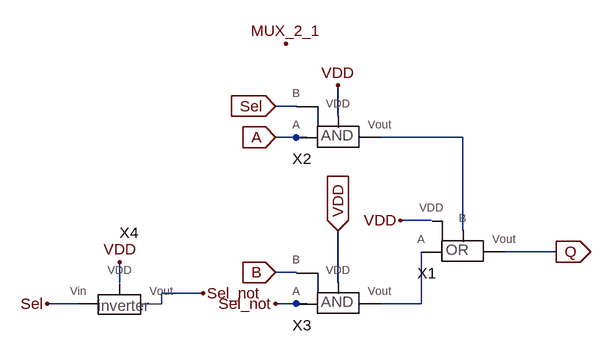
[diagram p0: schematic MUX_2_1.asc]
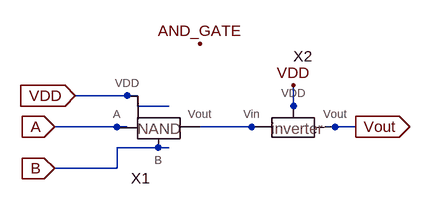
[diagram p1: sub-circuit and_gate.asc]
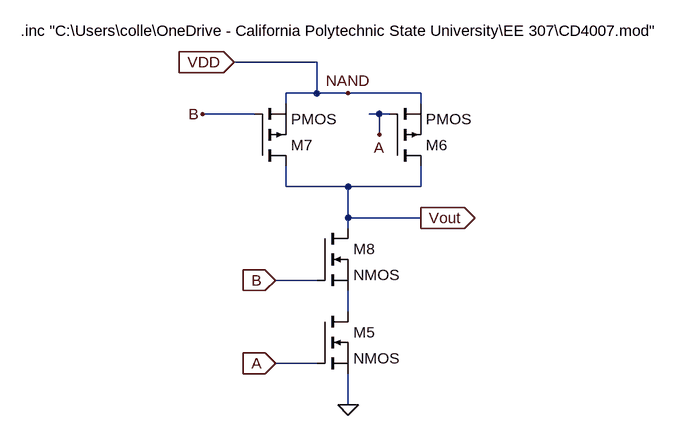
[diagram p2: sub-circuit nand_gate.asc]
MUX_2_1.asc, the LTspice schematic file:
Version 4
SHEET 1 880 680
WIRE -48 -80 -80 -80
WIRE 16 -64 16 -112
WIRE -48 -32 -80 -32
WIRE -32 -32 -48 -32
WIRE 208 -32 80 -32
WIRE 160 96 112 96
WIRE 208 112 208 -32
WIRE 352 144 272 144
WIRE -48 176 -80 176
WIRE -320 192 -320 160
WIRE 16 192 16 112
WIRE -192 208 -256 208
WIRE -384 224 -432 224
WIRE -256 224 -256 208
WIRE -48 224 -80 224
WIRE -32 224 -48 224
WIRE 144 224 144 144
WIRE 144 224 80 224
FLAG 352 144 Q
IOPIN 352 144 Out
FLAG -80 224 Sel_not
FLAG -80 176 B
IOPIN -80 176 In
FLAG -80 -32 A
IOPIN -80 -32 In
FLAG 16 112 VDD
IOPIN 16 112 In
FLAG 16 -112 VDD
FLAG 112 96 VDD
FLAG -80 -80 Sel
IOPIN -80 -80 In
FLAG -432 224 Sel
FLAG -192 208 Sel_not
FLAG -320 160 VDD
FLAG -64 -176 MUX_2_1
SYMBOL OR_gate 240 144 R0
SYMATTR InstName X1
SYMBOL AND_gate 48 -32 R0
SYMATTR InstName X2
SYMBOL AND_gate 48 224 R0
SYMATTR InstName X3
SYMBOL Inverter -288 240 R0
SYMATTR InstName X4

and_gate.asc, the sub-circuit schematic file:
Version 4
SHEET 1 880 680
WIRE 80 128 -16 128
WIRE 80 144 80 128
WIRE 128 144 80 144
WIRE 320 144 320 112
WIRE 320 160 320 144
WIRE 64 176 -48 176
WIRE 192 176 176 176
WIRE 256 176 192 176
WIRE 272 176 256 176
WIRE 384 176 368 176
WIRE 416 176 384 176
WIRE 128 208 48 208
WIRE 48 240 48 208
WIRE 48 240 -48 240
FLAG -16 128 VDD
IOPIN -16 128 In
FLAG -48 176 A
IOPIN -48 176 In
FLAG -48 240 B
IOPIN -48 240 In
FLAG 416 176 Vout
IOPIN 416 176 Out
FLAG 320 112 VDD
FLAG 176 48 AND_GATE
SYMBOL Nand_gate 160 192 R0
SYMATTR InstName X1
SYMBOL Inverter 352 192 R0
SYMATTR InstName X2

nand_gate.asc, the sub-circuit schematic file:
Version 4
SHEET 1 880 680
WIRE -224 -192 -352 -192
WIRE -224 -144 -224 -192
WIRE -224 -144 -272 -144
WIRE -176 -144 -224 -144
WIRE -64 -144 -176 -144
WIRE -272 -128 -272 -144
WIRE -64 -128 -64 -144
WIRE -320 -112 -400 -112
WIRE -128 -112 -144 -112
WIRE -112 -112 -128 -112
WIRE -128 -80 -128 -112
WIRE -272 0 -272 -32
WIRE -176 0 -272 0
WIRE -64 0 -64 -32
WIRE -64 0 -176 0
WIRE -176 48 -176 0
WIRE -64 48 -176 48
WIRE -176 64 -176 48
WIRE -224 144 -288 144
WIRE -176 192 -176 160
WIRE -224 272 -288 272
WIRE -176 336 -176 288
FLAG -176 -144 NAND
FLAG -176 336 0
FLAG -288 272 A
IOPIN -288 272 In
FLAG -128 -80 A
FLAG -400 -112 B
FLAG -288 144 B
IOPIN -288 144 In
FLAG -64 48 Vout
IOPIN -64 48 Out
FLAG -352 -192 VDD
IOPIN -352 -192 In
SYMBOL nmos -224 192 R0
SYMATTR InstName M5
SYMBOL pmos -112 -32 M180
SYMATTR InstName M6
SYMBOL pmos -320 -32 M180
SYMATTR InstName M7
SYMBOL nmos -224 64 R0
SYMATTR InstName M8
TEXT -680 -240 Left 2 !.inc "C:\\Users\\colle\\OneDrive - California Polytechnic State University\\EE 307\\CD4007.mod"

The netlist it stands for:
* MUX_2_1.asc
XX1 N002 N001 Q VDD OR_gate  ; pins A B Vout VDD
XX2 A VDD N001 Sel and_gate
XX3 Sel_not VDD N002 B and_gate
XX4 Sel VDD Sel_not Inverter  ; pins Vin VDD Vout

* block symbol definitions
.subckt and_gate A VDD Vout B
XX1 A B N001 VDD nand_gate
XX2 N001 VDD Vout Inverter  ; pins Vin VDD Vout
.ends and_gate

.subckt nand_gate A B Vout VDD
M5 N001 A 0 0 NMOS
M6 Vout A VDD VDD PMOS
M7 Vout B VDD VDD PMOS
M8 Vout B N001 N001 NMOS
.inc "C:\Users\colle\OneDrive - California Polytechnic State University\EE 307\CD4007.mod"
.ends nand_gate

.model NMOS NMOS
.model PMOS PMOS
.lib standard.mos
.backanno
.end